# Altium schematic sheet Schematic_LED_SHIELD_MOTOR_CONTROLLER_V2.SchDoc: LED SHIELD
size B; Author: Artem Dementyev; DrawnBy: Artem Dementyev; Revision: 1
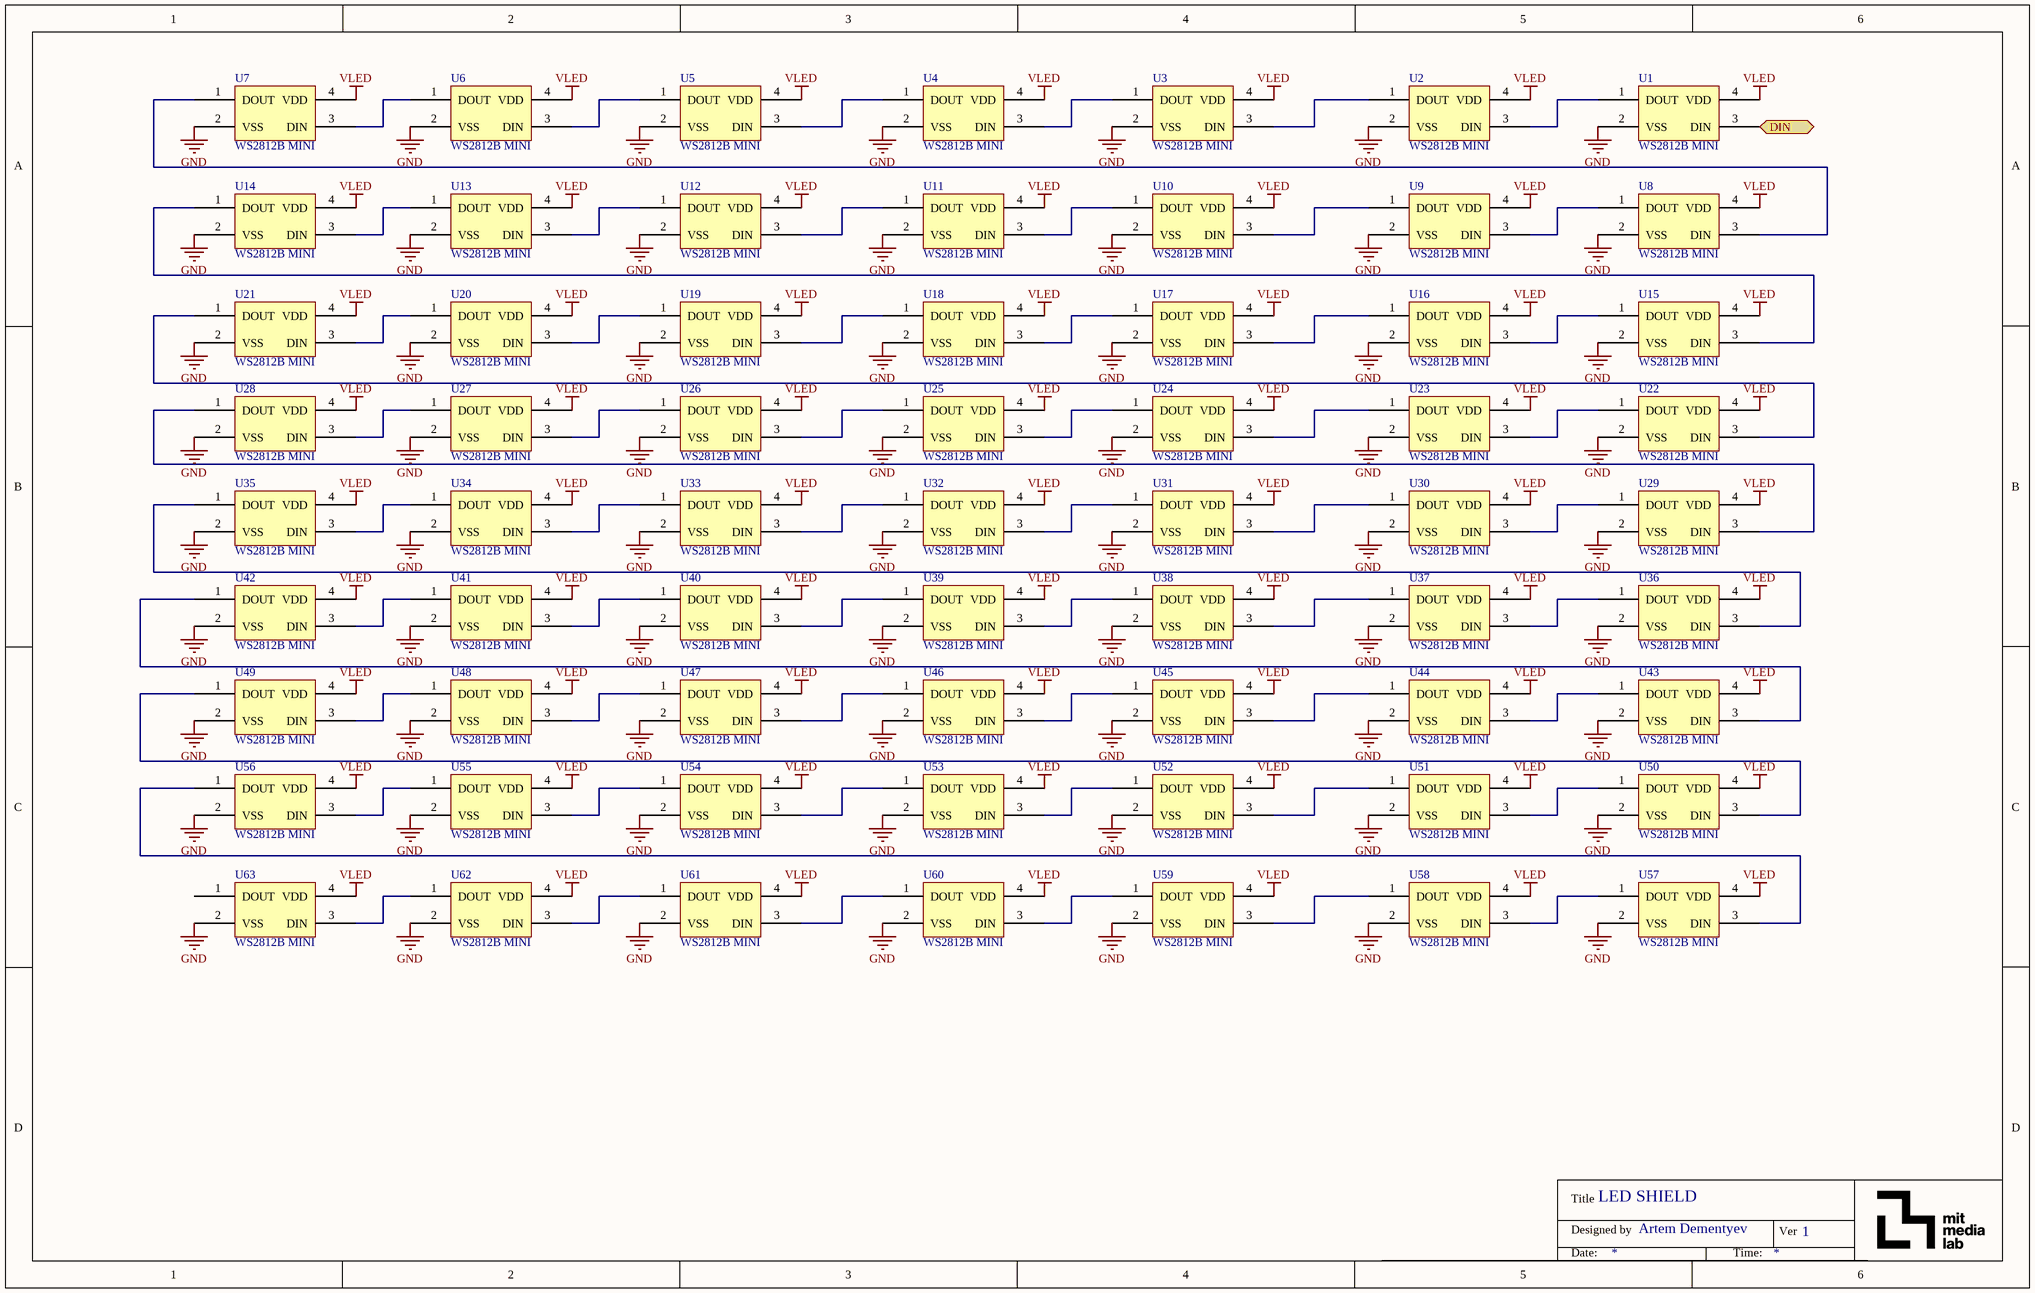
[diagram p0: Schematic_LED_SHIELD_MOTOR_CONTROLLER_V2.SchDoc]

## Parts
U1  WS2812B MINI  [WS2812B MINI]
U2  WS2812B MINI  [WS2812B MINI]
U3  WS2812B MINI  [WS2812B MINI]
U4  WS2812B MINI  [WS2812B MINI]
U5  WS2812B MINI  [WS2812B MINI]
U6  WS2812B MINI  [WS2812B MINI]
U7  WS2812B MINI  [WS2812B MINI]
U8  WS2812B MINI  [WS2812B MINI]
U9  WS2812B MINI  [WS2812B MINI]
U10  WS2812B MINI  [WS2812B MINI]
U11  WS2812B MINI  [WS2812B MINI]
U12  WS2812B MINI  [WS2812B MINI]
U13  WS2812B MINI  [WS2812B MINI]
U14  WS2812B MINI  [WS2812B MINI]
U15  WS2812B MINI  [WS2812B MINI]
U16  WS2812B MINI  [WS2812B MINI]
U17  WS2812B MINI  [WS2812B MINI]
U18  WS2812B MINI  [WS2812B MINI]
U19  WS2812B MINI  [WS2812B MINI]
U20  WS2812B MINI  [WS2812B MINI]
U21  WS2812B MINI  [WS2812B MINI]
U22  WS2812B MINI  [WS2812B MINI]
U23  WS2812B MINI  [WS2812B MINI]
U24  WS2812B MINI  [WS2812B MINI]
U25  WS2812B MINI  [WS2812B MINI]
U26  WS2812B MINI  [WS2812B MINI]
U27  WS2812B MINI  [WS2812B MINI]
U28  WS2812B MINI  [WS2812B MINI]
U29  WS2812B MINI  [WS2812B MINI]
U30  WS2812B MINI  [WS2812B MINI]
U31  WS2812B MINI  [WS2812B MINI]
U32  WS2812B MINI  [WS2812B MINI]
U33  WS2812B MINI  [WS2812B MINI]
U34  WS2812B MINI  [WS2812B MINI]
U35  WS2812B MINI  [WS2812B MINI]
U36  WS2812B MINI  [WS2812B MINI]
U37  WS2812B MINI  [WS2812B MINI]
U38  WS2812B MINI  [WS2812B MINI]
U39  WS2812B MINI  [WS2812B MINI]
U40  WS2812B MINI  [WS2812B MINI]
U41  WS2812B MINI  [WS2812B MINI]
U42  WS2812B MINI  [WS2812B MINI]
U43  WS2812B MINI  [WS2812B MINI]
U44  WS2812B MINI  [WS2812B MINI]
U45  WS2812B MINI  [WS2812B MINI]
U46  WS2812B MINI  [WS2812B MINI]
U47  WS2812B MINI  [WS2812B MINI]
U48  WS2812B MINI  [WS2812B MINI]
U49  WS2812B MINI  [WS2812B MINI]
U50  WS2812B MINI  [WS2812B MINI]
U51  WS2812B MINI  [WS2812B MINI]
U52  WS2812B MINI  [WS2812B MINI]
U53  WS2812B MINI  [WS2812B MINI]
U54  WS2812B MINI  [WS2812B MINI]
U55  WS2812B MINI  [WS2812B MINI]
U56  WS2812B MINI  [WS2812B MINI]
U57  WS2812B MINI  [WS2812B MINI]
U58  WS2812B MINI  [WS2812B MINI]
U59  WS2812B MINI  [WS2812B MINI]
U60  WS2812B MINI  [WS2812B MINI]
U61  WS2812B MINI  [WS2812B MINI]
U62  WS2812B MINI  [WS2812B MINI]
U63  WS2812B MINI  [WS2812B MINI]

## Ports
DIN

## Nets
GND: U1.2(VSS) U2.2(VSS) U3.2(VSS) U4.2(VSS) U5.2(VSS) U6.2(VSS) U7.2(VSS) U8.2(VSS) U9.2(VSS) U10.2(VSS) U11.2(VSS) U12.2(VSS) U13.2(VSS) U14.2(VSS) U15.2(VSS) U16.2(VSS) U17.2(VSS) U18.2(VSS) U19.2(VSS) U20.2(VSS) U21.2(VSS) U22.2(VSS) U23.2(VSS) U24.2(VSS) U25.2(VSS) U26.2(VSS) U27.2(VSS) U28.2(VSS) U29.2(VSS) U30.2(VSS) U31.2(VSS) U32.2(VSS) U33.2(VSS) U34.2(VSS) U35.2(VSS) U36.2(VSS) U37.2(VSS) U38.2(VSS) U39.2(VSS) U40.2(VSS) U41.2(VSS) U42.2(VSS) U43.2(VSS) U44.2(VSS) U45.2(VSS) U46.2(VSS) U47.2(VSS) U48.2(VSS) U49.2(VSS) U50.2(VSS) U51.2(VSS) U52.2(VSS) U53.2(VSS) U54.2(VSS) U55.2(VSS) U56.2(VSS) U57.2(VSS) U58.2(VSS) U59.2(VSS) U60.2(VSS) U61.2(VSS) U62.2(VSS) U63.2(VSS)
VLED: U1.4(VDD) U2.4(VDD) U3.4(VDD) U4.4(VDD) U5.4(VDD) U6.4(VDD) U7.4(VDD) U8.4(VDD) U9.4(VDD) U10.4(VDD) U11.4(VDD) U12.4(VDD) U13.4(VDD) U14.4(VDD) U15.4(VDD) U16.4(VDD) U17.4(VDD) U18.4(VDD) U19.4(VDD) U20.4(VDD) U21.4(VDD) U22.4(VDD) U23.4(VDD) U24.4(VDD) U25.4(VDD) U26.4(VDD) U27.4(VDD) U28.4(VDD) U29.4(VDD) U30.4(VDD) U31.4(VDD) U32.4(VDD) U33.4(VDD) U34.4(VDD) U35.4(VDD) U36.4(VDD) U37.4(VDD) U38.4(VDD) U39.4(VDD) U40.4(VDD) U41.4(VDD) U42.4(VDD) U43.4(VDD) U44.4(VDD) U45.4(VDD) U46.4(VDD) U47.4(VDD) U48.4(VDD) U49.4(VDD) U50.4(VDD) U51.4(VDD) U52.4(VDD) U53.4(VDD) U54.4(VDD) U55.4(VDD) U56.4(VDD) U57.4(VDD) U58.4(VDD) U59.4(VDD) U60.4(VDD) U61.4(VDD) U62.4(VDD) U63.4(VDD)
DIN: U1.3(DIN) ; port DIN
NetU1_1: U1.1(DOUT) U2.3(DIN)
NetU2_1: U2.1(DOUT) U3.3(DIN)
NetU3_1: U3.1(DOUT) U4.3(DIN)
NetU4_1: U4.1(DOUT) U5.3(DIN)
NetU5_1: U5.1(DOUT) U6.3(DIN)
NetU6_1: U6.1(DOUT) U7.3(DIN)
NetU7_1: U7.1(DOUT) U8.3(DIN)
NetU8_1: U8.1(DOUT) U9.3(DIN)
NetU9_1: U9.1(DOUT) U10.3(DIN)
NetU10_1: U10.1(DOUT) U11.3(DIN)
NetU11_1: U11.1(DOUT) U12.3(DIN)
NetU12_1: U12.1(DOUT) U13.3(DIN)
NetU13_1: U13.1(DOUT) U14.3(DIN)
NetU14_1: U14.1(DOUT) U15.3(DIN)
NetU15_1: U15.1(DOUT) U16.3(DIN)
NetU16_1: U16.1(DOUT) U17.3(DIN)
NetU17_1: U17.1(DOUT) U18.3(DIN)
NetU18_1: U18.1(DOUT) U19.3(DIN)
NetU19_1: U19.1(DOUT) U20.3(DIN)
NetU20_1: U20.1(DOUT) U21.3(DIN)
NetU21_1: U21.1(DOUT) U22.3(DIN)
NetU22_1: U22.1(DOUT) U23.3(DIN)
NetU23_1: U23.1(DOUT) U24.3(DIN)
NetU24_1: U24.1(DOUT) U25.3(DIN)
NetU25_1: U25.1(DOUT) U26.3(DIN)
NetU26_1: U26.1(DOUT) U27.3(DIN)
NetU27_1: U27.1(DOUT) U28.3(DIN)
NetU28_1: U28.1(DOUT) U29.3(DIN)
NetU29_1: U29.1(DOUT) U30.3(DIN)
NetU30_1: U30.1(DOUT) U31.3(DIN)
NetU31_1: U31.1(DOUT) U32.3(DIN)
NetU32_1: U32.1(DOUT) U33.3(DIN)
NetU33_1: U33.1(DOUT) U34.3(DIN)
NetU34_1: U34.1(DOUT) U35.3(DIN)
NetU35_1: U35.1(DOUT) U36.3(DIN)
NetU36_1: U36.1(DOUT) U37.3(DIN)
NetU37_1: U37.1(DOUT) U38.3(DIN)
NetU38_1: U38.1(DOUT) U39.3(DIN)
NetU39_1: U39.1(DOUT) U40.3(DIN)
NetU40_1: U40.1(DOUT) U41.3(DIN)
NetU41_1: U41.1(DOUT) U42.3(DIN)
NetU42_1: U42.1(DOUT) U43.3(DIN)
NetU43_1: U43.1(DOUT) U44.3(DIN)
NetU44_1: U44.1(DOUT) U45.3(DIN)
NetU45_1: U45.1(DOUT) U46.3(DIN)
NetU46_1: U46.1(DOUT) U47.3(DIN)
NetU47_1: U47.1(DOUT) U48.3(DIN)
NetU48_1: U48.1(DOUT) U49.3(DIN)
NetU49_1: U49.1(DOUT) U50.3(DIN)
NetU50_1: U50.1(DOUT) U51.3(DIN)
NetU51_1: U51.1(DOUT) U52.3(DIN)
NetU52_1: U52.1(DOUT) U53.3(DIN)
NetU53_1: U53.1(DOUT) U54.3(DIN)
NetU54_1: U54.1(DOUT) U55.3(DIN)
NetU55_1: U55.1(DOUT) U56.3(DIN)
NetU56_1: U56.1(DOUT) U57.3(DIN)
NetU57_1: U57.1(DOUT) U58.3(DIN)
NetU58_1: U58.1(DOUT) U59.3(DIN)
NetU59_1: U59.1(DOUT) U60.3(DIN)
NetU60_1: U60.1(DOUT) U61.3(DIN)
NetU61_1: U61.1(DOUT) U62.3(DIN)
NetU62_1: U62.1(DOUT) U63.3(DIN)

Not connected (* = marked no-connect by the designer): U63 1(DOUT)

## Notes on the sheet
- Title
- Designed by
- Ver
- Date:
- Time: